# Altium schematic sheet Door.SchDoc
size A4
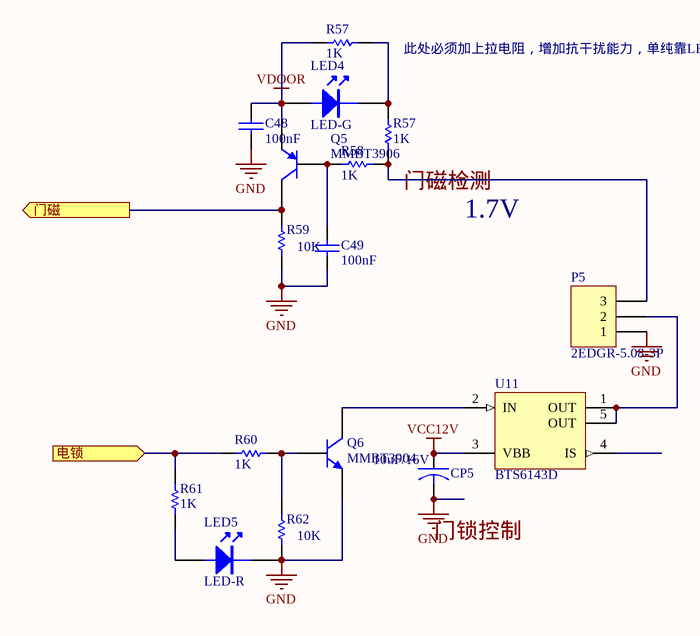
[diagram p0: Door.SchDoc]

## Parts
(Parts that share a designator on the sheet are numbered #1, #2 ... from top to bottom, then left to right.)
C48  value 100nF  [2012[0805]06CD]  (hidden comment: CAP 100nF 50V 0805(2012))
C49  value 100nF  [2012[0805]06CD]  (hidden comment: CAP 100nF 50V 0805(2012))
CP5  value 10uF/16V  [3216[1206]CB]  (hidden comment: TAJA106K016RNJ)
LED4  LED-G  [0805LED]
LED5  LED-R  [0805LED]
P5  2EDGR-5.08-3P  [2EDGR-5.08-3P]
Q5  MMBT3906  [SOT23B_N]
Q6  MMBT3904  [SOT23_N]
R57#1  value 1K  [2012[0805]R]  (hidden comment: 1K 1% 0805(2012))
R57#2  value 1K  [2012[0805]R]  (hidden comment: 1K 1% 0805(2012))
R58  value 1K  [2012[0805]R]  (hidden comment: 1K 1% 0805(2012))
R59  value 10K  [2012[0805]R]  (hidden comment: 10K 1% 0805(2012))
R60  value 1K  [2012[0805]R]  (hidden comment: 1K 1% 0805(2012))
R61  value 1K  [2012[0805]R]  (hidden comment: 1K 1% 0805(2012))
R62  value 10K  [2012[0805]R]  (hidden comment: 10K 1% 0805(2012))
U11  BTS6143D  [INF-PG-TO252-5-11_M]

## Ports
电锁 (in), 门磁 (out)

## Nets
GND: C48.2 C49.2 CP5.2 LED5.2 P5.1 Q6.2(E) R59.1 R62.1
VCC12V: CP5.1 U11.3(VBB)
VDOOR: C48.1 LED4.1 Q5.2(E) R57#1.2
电锁: R60.2 R61.1 ; port 电锁
门磁: Q5.3(C) R59.2 ; port 门磁
NetC49_1: C49.1 Q5.1(B) R58.1
NetLED4_2: LED4.2 R57#1.1 R57#2.2
NetLED5_1: LED5.1 R61.2
NetP5_2: P5.2 U11.1(OUT) U11.5(OUT)
NetP5_3: P5.3 R57#2.1 R58.2
NetQ6_1: Q6.1(B) R60.1 R62.2
NetQ6_3: Q6.3(C) U11.2(IN)

Not connected (* = marked no-connect by the designer): U11 4(IS)

## Notes on the sheet
- (near R57#1) 此处必须加上拉电阻，增加抗干扰能力，单纯靠LED的上拉不起作用
- 门磁检测
- 1.7V
- (near CP5) 门锁控制

## Library data of the parts
C48 C49 = CMP-1036-04418-1: CAP 100nF 50V ±5% 0805 (2012 Metric) Thickness 1mm SMD; Case-EIA: 0805; Case-Metric: 2012; Tolerance: ±5%; Max Thickness: 1 mm; Technology: SMT; Rated Voltage: 50 V
CP5 = CAPACITOR: 钽质电容器-固体SMD 16volts 10uF 10%; Manufacturer: AVX; ESR: 3 Ohms; 产品: Tantalum Solid Standard Grade - Other Various; 产品种类: SMD Tantalum Capacitors; 制造商库存号: A Case; 外壳代码 - in: 1206; 外壳代码 - mm: 3216; 封装 / 箱体: 1206 (3216 metric); 封装: Reel; 尺寸: 1.6 mm W x 3.2 mm L; 工作温度范围: - 55 C to + 125 C; 损耗因数 DF: 8; 标准包装数量: 2000; 漏泄电流: 1.6 uA; 电压额定值: 16 V; 端接类型: SMD/SMT; 系列: TAJ; 高度: 1.8 mm; Category: 钽质电容器-固体SMD; ComponentLink1Description: http://www.avx.com/docs/Catalogs/taj.pdf; ComponentLink1URL: http://www.avx.com/docs/Catalogs/taj.pdf; Description 1: 钽质电容器-固体SMD 16volts 10uF 10%; Manufacturer Part Number: TAJA106K016RNJ; Minimum Order Quantity: 1; Pricing 1: 1=0.600, 100=0.280, 200=0.250, 500=0.221, 1000=0.200, 2000=0.140, 5000=0.131, 10000=0.124, 25000=0.103 (USD); Reeling: True; RoHS - 贸泽: Y; RoHS: RoHS Compliant; Stock 1: 20335; Supplier 1: Mouser; Supplier Part Number 1: 581-TAJA106K016R; 制造商: AVX; 容差: 10 %; 电容: 10 uF
LED4 = LED: 绿色LED
LED5 = LED: 红色LED
P5 = Header 3: Header, 3-Pin; LatestRevisionDate: 17-Jul-2002; LatestRevisionNote: Re-released for DXP Platform.; Publisher: Altium Limited
Q5 = MMBT3906: PNP Switching Transistor; Published: 17-Sep-2003; LatestRevisionDate: 12-Dec-2006; LatestRevisionNote: IPC-7351 Footprint Added.; DatasheetVersion: 11-Apr-2000; PackageVersion: May-1999; PackageReference: SOT23; Publisher: Altium Limited; PackageDescription: 3-Pin SOT-23 Package 0.95 mm Pitch, 2.3 mm Lead Span; ComponentLink1Description: Manufacturer Link; ComponentLink1URL: http://www.semiconductors.philips.com/; ComponentLink2Description: Datasheet; ComponentLink2URL: http://www.semiconductors.philips.com/acrobat/datasheets/MMBT3906_2.pdf
Q6 = MMBT3904: NPN Switching Transistor; Published: 17-Sep-2003; LatestRevisionDate: 12-Dec-2006; LatestRevisionNote: IPC-7351 Footprint Added.; DatasheetVersion: 13-May-2002; PackageVersion: May-1999; PackageReference: SOT23; Publisher: Altium Limited; PackageDescription: 3-Pin SOT-23 Package 0.95 mm Pitch, 2.3 mm Lead Span; ComponentLink1Description: Manufacturer Link; ComponentLink1URL: http://www.semiconductors.philips.com/; ComponentLink2Description: Datasheet; ComponentLink2URL: http://www.semiconductors.philips.com/acrobat/datasheets/MMBT3904_4.pdf
R57#1 R57#2 R58 R60 R61 = CMP-1013-00510-1: 1K 0.125W 1% 0805 (2012 Metric)  SMD; Case-Metric: 2012; Case-EIA: 0805; Tolerance: 1 %; Power: 0.125 W; Technology: SMT
R59 R62 = CMP-1013-00623-1: 10K 0.125W 1% 0805 (2012 Metric)  SMD; Case-Metric: 2012; Case-EIA: 0805; Tolerance: 1 %; Power: 0.125 W; Technology: SMT
U11 = CMP-1095-00112-1: PROFET Smart Highside Power Switch, 1 Channel, 10 A Load Current, -40 to 150 degC, PG-TO252-5-11, Reel, Green; Manufacturer: Infineon; Recommended Operating Voltage Min.: 5.5 V; RON(max) @ 150degreesC: 18 mOhm; toff (max): 500 us; Load Current (typ): 10 A; RON @ 25degreesC: 10 mOhm; Recommended Operating Voltage Max.: 38 V; Green: TRUE; Ptot (max): 59 W; Group: Automotive Qualified; Channels: 1; Packing: Reel; ComponentLink1URL: http://www.infineon.com/; PartNumber: BTS6143D; Mounting Technology: Surface Mount; ComponentLink2Description: Datasheet; ComponentLink3URL: http://www.infineon.com/dgdl/TLE7276-Data+Sheet-+v1_11.pdf?folderId=db3a304412b407950112b408e8c90004&fileId=db3a304412b407950112b436c53f66c8&sId=db3a30433db6f09f013dc0e43c0428c1; ComponentLink3Description: Package Specification; ComponentLink2URL: http://www.infineon.com/dgdl/BTS6143D_DS_v10.pdf?folderId=db3a304314dca389011537739e37155f&fileId=db3a3043183a95550118606a2705368e&location=en.Products.Automotive_ICs.Smart_High-_and_Low-Side_Switches.PROFET__-_Smart_High_Side_Switches.DATASHEET.BTS6143D_D; ComponentLink1Description: Manufacturer URL; PackageVersion: Nov-10; PackageDescription: 5-Pin Plastic (Green) Transistor Single Outline Package, 6.5 x 6.12 mm Body, 1.14 mm Pitch; Halogen-free: TRUE; DatasheetVersion: Rev. 1.0; PackageReference: PG-TO252-5-11; ton (max): 500 us